# Altium schematic sheet AMU-S08-V00-IDCloops.SchDoc: BMS Interface
size A3; DrawnBy: Thomas Benedetti; DocumentNumber: 8; SheetNumber: 8; SheetTotal: 12; Version: 00; Project: AMU 2020; PageSetup: Record=PageOptions|CenterHorizontal=True|CenterVertical=True|PrintScale=0.97|XCorrection=1.00|YCorrection=1.00|PrintKind=0|BorderSize=5000000|LeftOffset=0|BottomOffset=0|Orientation=2|PaperLength=1000|PaperWidth=1000|Scale=100|PaperSource=7|PrintQuality=-4|MediaType=1|DitherType=10|PaperKind=A4|PrintScaleMode=1
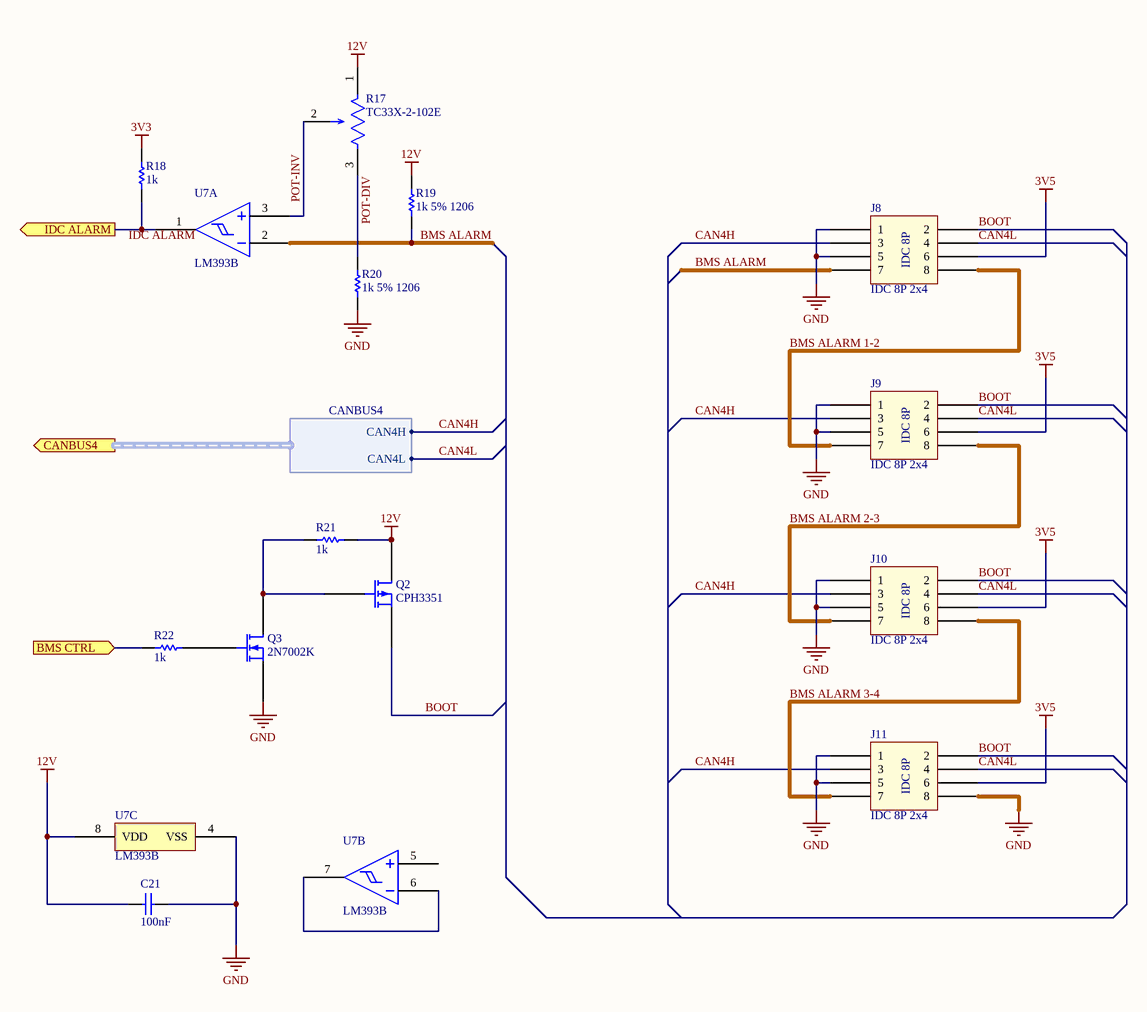
[diagram p0: AMU-S08-V00-IDCloops.SchDoc]

## Parts
C21  100nF  [Cap_Ceramic_0603]
J8  IDC 8P 2x4  [IDC 2.54MM 8P]
J9  IDC 8P 2x4  [IDC 2.54MM 8P]
J10  IDC 8P 2x4  [IDC 2.54MM 8P]
J11  IDC 8P 2x4  [IDC 2.54MM 8P]
Q2  CPH3351  [SOT-23-3]
Q3  2N7002K  [SOT-23-3]
R17  TC33X-2-102E  [TC33]
R18  1k  [Res_ThinFilm_0603]
R19  1k 5% 1206  [Res_ThinFilm_1206]
R20  1k 5% 1206  [Res_ThinFilm_1206]
R21  1k  [Res_ThinFilm_0603]
R22  1k  [Res_ThinFilm_1206]
U7  LM393B  [SOIC-8]  (parts A,B,C of 3)

## Ports
BMS CTRL (in), CANBUS4 (out, harness CANBUS4), IDC ALARM (out)

## Harnesses
CANBUS4: CAN4H, CAN4L

## Nets
3V3: R18.2
3V5: J8.6 J9.6 J10.6 J11.6
12V: C21.1 Q2.D R17.1 R19.2 R21.2 U7.8(VDD)
GND: C21.2 J8.1 J8.5 J9.1 J9.5 J10.1 J10.5 J11.1 J11.5 J11.8 Q3.S R20.1 U7.4(VSS)
BMS ALARM: J8.7 R19.1 U7.2(IN1-)
BMS ALARM 1-2: J8.8 J9.7
BMS ALARM 2-3: J9.8 J10.7
BMS ALARM 3-4: J10.8 J11.7
BMS CTRL: R22.1 ; port BMS CTRL
BOOT: J8.2 J9.2 J10.2 J11.2 Q2.S
CAN4H: J8.3 J9.3 J10.3 J11.3 ; port CANBUS4.CAN4H
CAN4L: J8.4 J9.4 J10.4 J11.4 ; port CANBUS4.CAN4L
IDC ALARM: R18.1 U7.1(OUT1) ; port IDC ALARM
POT-DIV: R17.3 R20.2
POT-INV: R17.2 U7.3(IN1+)
NetQ2_G: Q2.G Q3.D R21.1
NetQ3_G: Q3.G R22.2
NetU7_6: U7.6(IN2-) U7.7(OUT1)

Not connected (* = marked no-connect by the designer): U7 5(IN2+)

## Notes on the sheet
- Labels drawn without touching a wire or pin: IDC ALARM
- Revision History:
- Sheet Title:
- Rev
- Date
- Description
- Project:
- Size:
- Drawn By:
- A3
- Number:
- Revision:
- Sheet
- Version:
- of
- QUT Motorsport
- O-120, Gardens Point
- 2 George Street
- Brisbane, QLD 4000
- Australia
- Print Date:
- Print Time:
- File Name:
- (in symbol IDC 8P 2x4) IDC 8P

## Library data of the parts
C21 = 100nF 50V 5% X7R 0603: Capacitor, Ceramic, SMD, 100nF, 50V, 5%, X7R, 0603
Q2 = CPH3351: P-Channel 60V 1.8A (Ta) 1W (Ta) Surface Mount 3-CPH; ComponentLink1Description: Datasheet; ComponentLink1URL: https://www.onsemi.com/pub/Collateral/CPH3351-D.PDF; ComponentLink2Description: Digikey; ComponentLink2URL: https://www.digikey.com/products/en/discrete-semiconductor-products/transistors-fets-mosfets-single/278?k=&pkeyword=&sv=0&pv7=2&sf=0&FV=-1%7C488%2C-8%7C278&mpart=CPH3351-TL-W&quantity=&ColumnSort=0&page=1&stock=1&nstock=1&datasheet=1&photo=1&pageSize=25
Q3 = 2N7002K: N-Channel 60V 300mA (Ta) 350mW (Ta) Surface Mount SOT-23 (TO-236AB)
R17 = TC33X-2-102E: 1 kOhms 0.1W, 1/10W J Lead Surface Mount Trimmer Potentiometer Cermet 1 Turn Top Adjustment
R18 R21 = 1k 5% 0603: Resistor, SMD, 1k, 0.1W, 5%, 0603
R19 R20 R22 = 1k 5% 1206: 1 kOhms ±5% 0.25W, 1/4W Chip Resistor 1206 (3216 Metric) Moisture Resistant Thick Film; ComponentLink1Description: Datasheet; ComponentLink1URL: https://www.yageo.com/upload/media/product/productsearch/datasheet/rchip/PYu-RC_Group_51_RoHS_L_10.pdf
U7 = LM393B: Comparator General Purpose Open-Collector 8-SOIC